# EAGLE schematic keyboard_adc (EAGLE 5.11)
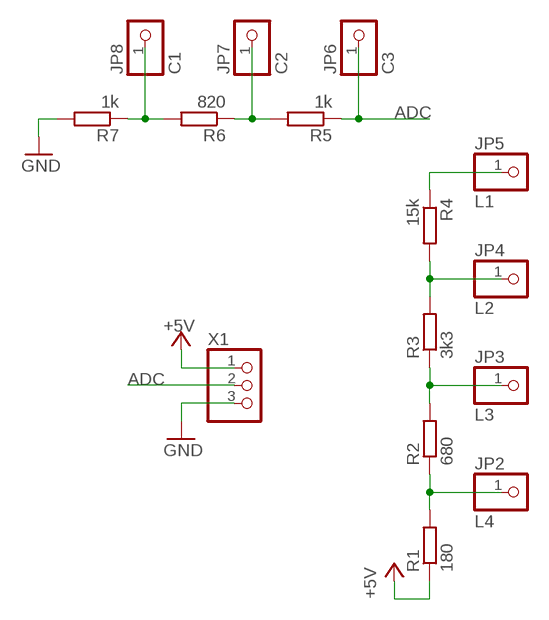
[diagram p0: schematic, sheet 1]

## Parts
JP2  L4  PINHD-1X1  [1X01]
JP3  L3  PINHD-1X1  [1X01]
JP4  L2  PINHD-1X1  [1X01]
JP5  L1  PINHD-1X1  [1X01]
JP6  C3  PINHD-1X1  [1X01]
JP7  C2  PINHD-1X1  [1X01]
JP8  C1  PINHD-1X1  [1X01]
R1  180  R-EU_  [0207/7]
R2  680  R-EU_  [0207/7]
R3  3k3  R-EU_  [0207/7]
R4  15k  R-EU_  [0207/7]
R5  1k  R-EU_  [0207/7]
R6  820  R-EU_  [0207/7]
R7  1k  R-EU_  [0207/7]
X1  22-23-2031  [22-23-2031]

## Nets
+5V: R1.1 X1.1
ADC: JP6.1 R5.1 X1.2
GND: R7.2 X1.3
N$2: JP2.1 R1.2 R2.1
N$3: JP3.1 R2.2 R3.1
N$4: JP4.1 R3.2 R4.2
N$5: JP5.1 R4.1
N$7: JP8.1 R6.2 R7.1
N$8: JP7.1 R5.2 R6.1

## Library data of the parts
JP2-JP8 = keyboard_adc:PINHD-1X1: PIN HEADER
R1-R7 = keyboard_adc:R-EU_: RESISTOR, European symbol
X1 = keyboard_adc:22-23-2031: .100" (2.54mm) Center Header - 3 Pin